# EAGLE schematic led_with_pwm (EAGLE 7.1.0)
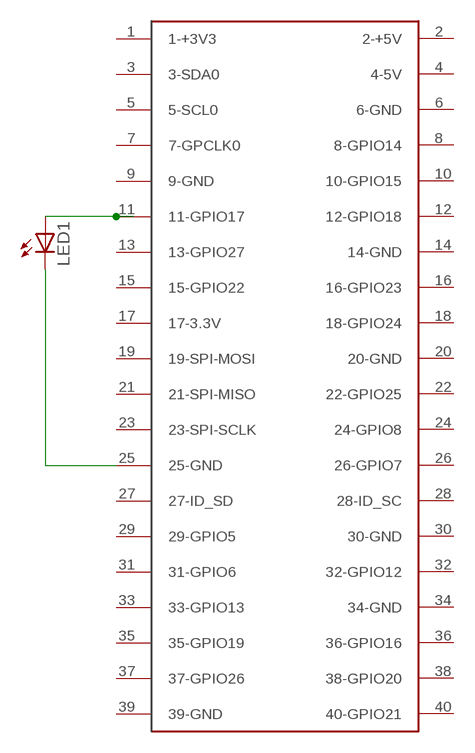
[diagram p0: schematic, sheet 1]

## Parts
LED1  LED  [SMARTLED-TTW]
U$1  RASPBERRY-PI  [RASPBERRY-PI]

## Nets
N$1: LED1.A@1(A) U$1.11(11-GPIO17)
N$2: LED1.C@1(C) U$1.25(25-GND)
Unconnected: U$1.1(1-+3V3) U$1.2(2-+5V) U$1.3(3-SDA0) U$1.4(4-5V) U$1.5(5-SCL0) U$1.6(6-GND) U$1.7(7-GPCLK0) U$1.8(8-GPIO14) U$1.9(9-GND) U$1.10(10-GPIO15) U$1.12(12-GPIO18) U$1.13(13-GPIO27) U$1.14(14-GND) U$1.15(15-GPIO22) U$1.16(16-GPIO23) U$1.17(17-3.3V) U$1.18(18-GPIO24) U$1.19(19-SPI-MOSI) U$1.20(20-GND) U$1.21(21-SPI-MISO) U$1.22(22-GPIO25) U$1.23(23-SPI-SCLK) U$1.24(24-GPIO8) U$1.26(26-GPIO7) U$1.27(27-ID_SD) U$1.28(28-ID_SC) U$1.29(29-GPIO5) U$1.30(30-GND) U$1.31(31-GPIO6) U$1.32(32-GPIO12) U$1.33(33-GPIO13) U$1.34(34-GND) U$1.35(35-GPIO19) U$1.36(36-GPIO16) U$1.37(37-GPIO26) U$1.38(38-GPIO20) U$1.39(39-GND) U$1.40(40-GPIO21)

## Library data of the parts
LED1 = adafruit:LED: LED OSRAM: - CHIPLED LG R971, LG N971, LY N971, LG Q971, LY Q971, LO R971, LY R971 LH N974, LH R974 LS Q976, LO Q976, LY Q976 LO Q996 - Hyper CHIPLED LW Q18S LB Q993, LB Q99A, LB R99A - SideLED LS A670, LO A670, LY A670, LG A670, LP A670 LB A673, LV A673, LT A673, LW A673 LH A674 LY A675 LS A676, LA A676, LO A676, LY A676, LW A676 LS A679, LY A679, LG A679 - Hyper Micro SIDELED® LS Y876, LA Y876, LO Y876, LY Y876 LT Y87S - SmartLED LW L88C, LW L88S LB L89C, LB L89S, LG L890 LS L89K, LO L89K, LY L89K LS L896, LA L896, LO L896, LY L896 - TOPLED LS T670, LO T670, LY T670, LG T670, LP T670 LSG T670, LSP T670, LSY T670, LOP T670, LYG T670 LG T671, LOG T671, LSG T671 LB T673, LV T673, LT T673, LW T673 LH T674 LS T676, LA T676, LO T676, LY T676, LB T676, LH T676, LSB T676, LW T676 LB T67C, LV T67C, LT T67C, LS T67K, LO T67K, LY T67K, LW E67C LS E67B, LA E67B, LO E67B, LY E67B, LB E67C, LV E67C, LT E67C LW T67C LS T679, LY T679, LG T679 LS T770, LO T770, LY T770, LG T770, LP T770 LB T773, LV T773, LT T773, LW T773 LH T774 LS E675, LA E675, LY E675, LS T675 LS T776, LA T776, LO T776, LY T776, LB T776 LHGB T686 LT T68C, LB T68C - Hyper Mini TOPLED® LB M676 - Mini TOPLED Santana® LG M470 LS M47K, LO M47K, LY M47K Source: http://www.osram.convergy.de/
U$1 = aliEagleLib:RASPBERRY-PI: Raspberry Pi Board <http://www.raspberrypi.org/> Jacques Lagnel V1.0 (beta) 2012 Board dimension: Forum 3D model <http://www.raspberrypi.org/forum/general-discussion/mechanical-profile-3d-models?value=3d%20model&type=1&include=1&search=1&ret=all> The GPIO Connector (P1): http://elinux.org/RPi_Low-level_peripherals